# EAGLE design Raincenter_MAX232_Adapter (EAGLE 6.6.0)
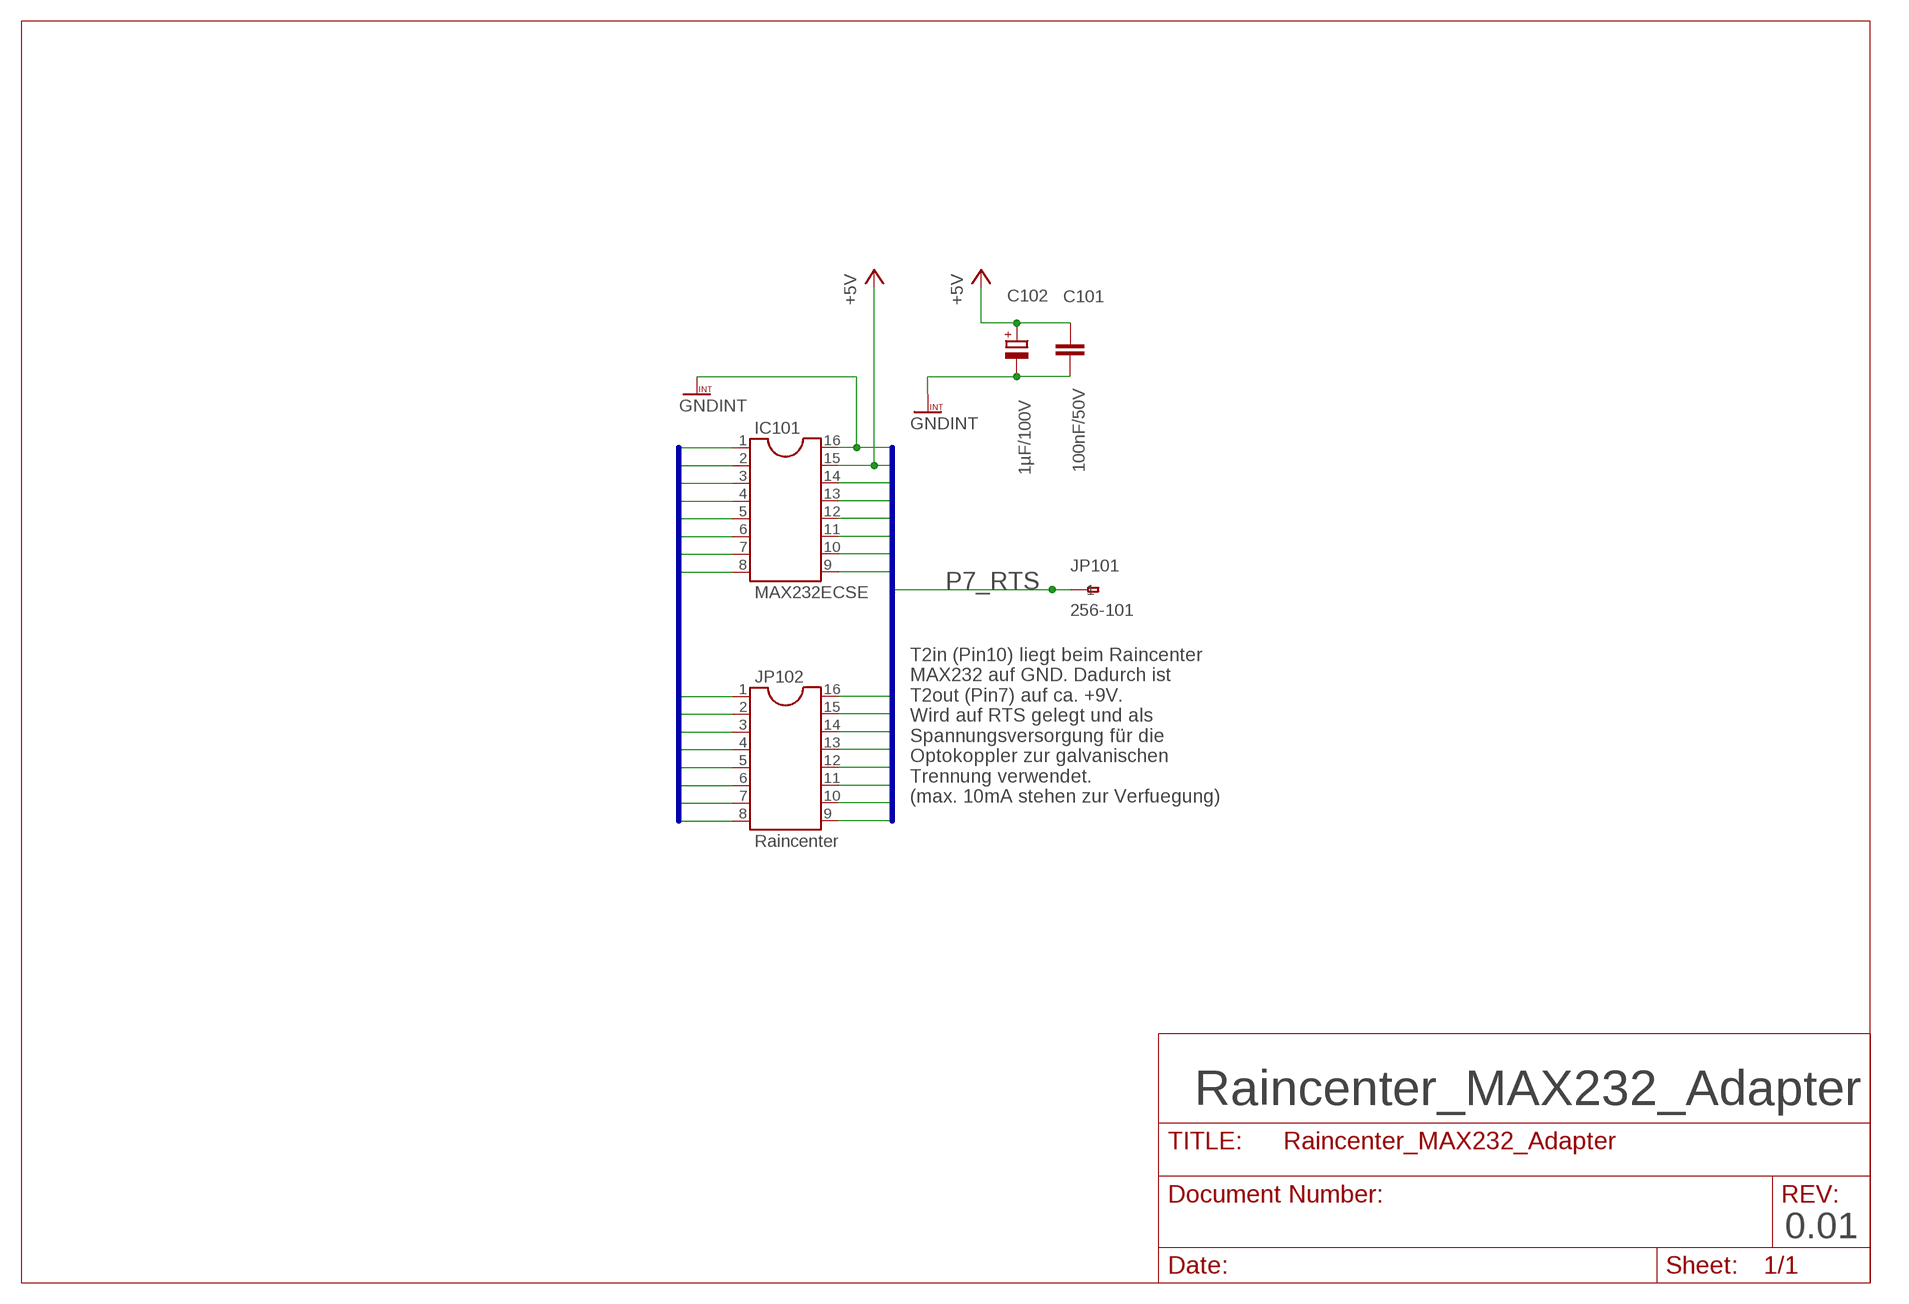
[diagram p0: schematic, sheet 1]

## Parts
C101  100nF/50V  C-EU025-024X044  [C025-024X044]
C102  1µF/100V  CPOL-EUE2.5-6  [E2,5-6]
IC101  MAX232ECSE  DIL16S  [SOCKET-16]
JP101  256-101  [255-401-5]
JP102  Raincenter  DIL16S  [SOCKET-16]

## Nets
+5V: C101.1 C102.+ IC101.15 JP102.2
GNDINT: C101.2 C102.- IC101.16 JP102.1
P1: IC101.1 JP102.16
P2: IC101.2 JP102.15
P3: IC101.3 JP102.14
P4: IC101.4 JP102.13
P5: IC101.5 JP102.12
P6: IC101.6 JP102.11
P7_RTS: IC101.7 JP101.A1 JP101.B1 JP102.10
P8: IC101.8 JP102.9
P9: IC101.9 JP102.8
P10: IC101.10 JP102.7
P11: IC101.11 JP102.6
P12: IC101.12 JP102.5
P13: IC101.13 JP102.4
P14: IC101.14 JP102.3

## Buses
P[1..6],P7_RTS,P[8..14],GNDINT,+5V

## Notes on the sheet
- T2in (Pin10) liegt beim Raincenter
  MAX232 auf GND. Dadurch ist
  T2out (Pin7) auf ca. +9V.
  Wird auf RTS gelegt und als
  Spannungsversorgung für die
  Optokoppler zur galvanischen
  Trennung verwendet.
  (max. 10mA stehen zur Verfuegung)
- Raincenter_MAX232_Adapter
- 0.01

## Library data of the parts
C101 = rcl:C-EU: CAPACITOR, European symbol; MN: Murata; REICHELT: X7R-2,5 100N
C102 = rcl:CPOL-EU: POLARIZED CAPACITOR, European symbol; REICHELT: RAD 105 1,0/100
IC101 = ic-package:DIL16: Dual In Line / Socket; REICHELT: GS 16P
JP101 = Klemmen:256-101; CONRAD: 1x730366 + 1x730378; MN: WAGO; MPN: 1x 256-101 + 1x 256-100
JP102 = ic-package:DIL16: Dual In Line / Socket; MF: ASSMANN; MPN: AR-16-ST/T; REICHELT: AR 16

## Board
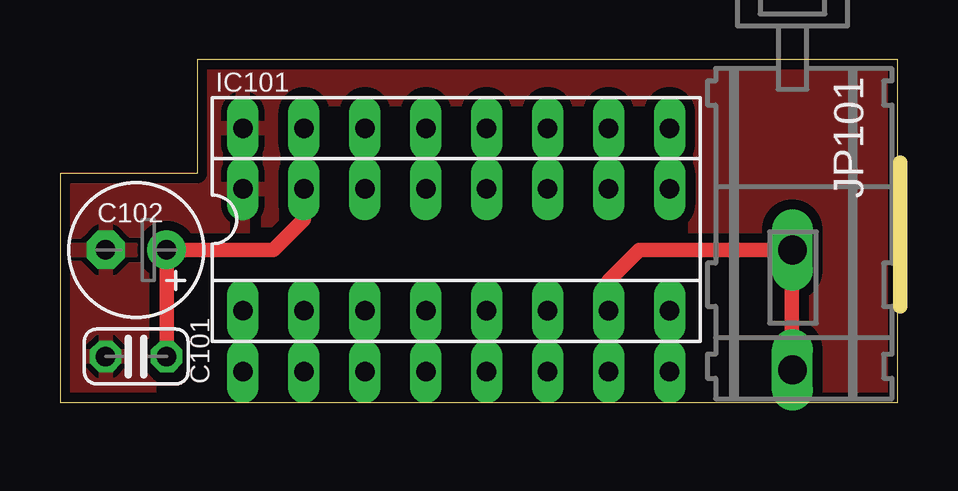
[diagram p1: board, top side]
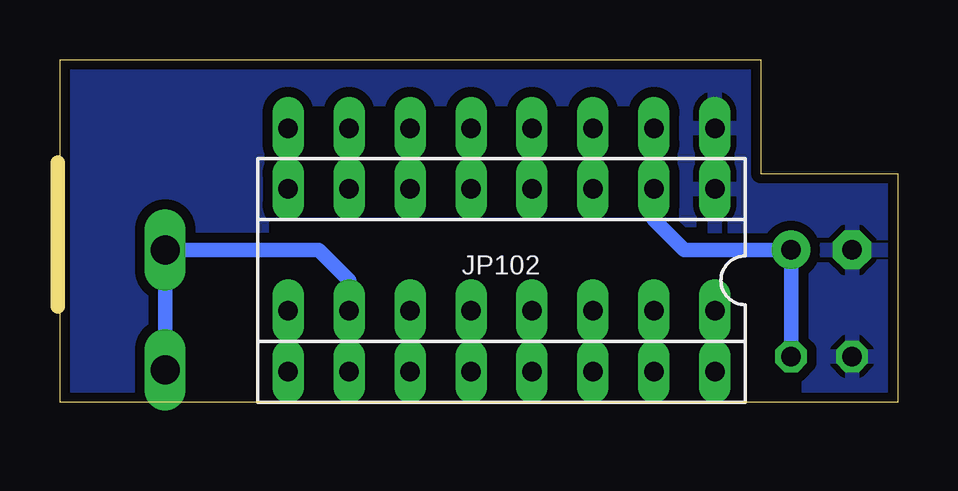
[diagram p2: board, bottom side, seen from below]

Size 34.91 x 14.28 mm. Coordinates in mm from the lower left corner, seen from the top.
Outline: 0,0 34.91,0 34.91,14.28 5.71,14.28 5.71,9.53 0,9.53 0,0
Copper layers (1*16): Top 0.035mm / dielectric 1.5mm / Bottom 0.035mm
Design rules "aisler_2_layer *": minimum track width 0.1mm, minimum drill 0.2mm, track to track 0.1mm, track to pad 0.1mm, pad to pad 0.1mm, via to via 0.1mm, smd to smd 0.1mm, copper to edge 0.2mm, drill to drill 0.21mm, minimum pad ring 0.25mm, minimum via ring 0.15mm, stop-mask expansion 0mil, vias tented up to drill 0mil, thermal gap 10mil
Milling: 1 lines

### Footprints (pad centres in the part's own frame; a part is rotated, then mirrored left to right if it is on the bottom)
C025-024X044 = drill 0.813 octagon: 1 -1.27,0; 2 1.27,0
E2,5-6 = drill 0.813 pad 1.6: + -1.27,0 | drill 0.813 pad 1.6 octagon: - 1.27,0
SOCKET-16 = drill 0.813 long: 1 -8.89,-3.81; 2 -6.35,-3.81; 3 -3.81,-3.81; 4 -1.27,-3.81; 5 1.27,-3.81; 6 3.81,-3.81; 7 6.35,-3.81; 8 8.89,-3.81; 9 8.89,3.81; 10 6.35,3.81; 11 3.81,3.81; 12 1.27,3.81; 13 -1.27,3.81; 14 -3.81,3.81; 15 -6.35,3.81; 16 -8.89,3.81
255-401-5 = drill 1.2 long: A1 -2.5,0; B1 -2.5,-5

### Placement (x,y rotation side)
C101  3.17,1.91 180 top
C102  3.17,6.35 180 top
IC101  16.51,7.62 0 top
JP101  33.02,6.35 0 top
JP102  16.51,5.08 180 bottom

### Tracks (layer width: path | path; a pad name or v marks a point on that pad's centre or on a via)
+5V
  Top 0.61: C101.1 C102.+ 8.89,6.35 10.16,7.62 JP102.2 IC101.15
  Bottom 0.61: IC101.15 JP102.2 10.16,7.62 8.89,6.35 C102.+ C101.1
GNDINT
  pour Bottom (isolate 0.406): 0,0 34.92,0 34.92,14.61 5.71,14.61 5.71,9.53 0,9.53
  pour Top (isolate 0.406): 0,0 34.92,0 34.92,14.61 5.71,14.61 5.71,9.53 0,9.53
P1
  Top 0.61: JP102.16 IC101.1
  Bottom 0.61: IC101.1 JP102.16
P2
  Top 0.61: IC101.2 JP102.15
  Bottom 0.61: IC101.2 JP102.15
P3
  Top 0.61: IC101.3 JP102.14
  Bottom 0.61: IC101.3 JP102.14
P4
  Top 0.61: JP102.13 IC101.4
  Bottom 0.61: IC101.4 JP102.13
P5
  Top 0.61: IC101.5 JP102.12
  Bottom 0.61: IC101.5 JP102.12
P6
  Top 0.61: JP102.11 IC101.6
  Bottom 0.61: IC101.6 JP102.11
P7_RTS
  Top 0.61: JP102.10 22.86,5.08 24.13,6.35 30.48,6.35 30.48,1.27
  Bottom 0.61: JP101.B1 JP101.A1 24.13,6.35 22.86,5.08 IC101.7 JP102.10
P8
  Top 0.61: JP102.9 IC101.8
  Bottom 0.61: IC101.8 JP102.9
P9
  Top 0.61: IC101.9 JP102.8
  Bottom 0.61: JP102.8 IC101.9
P10
  Top 0.61: IC101.10 JP102.7
  Bottom 0.61: JP102.7 IC101.10
P11
  Top 0.61: IC101.11 JP102.6
  Bottom 0.61: JP102.6 IC101.11
P12
  Top 0.61: IC101.12 JP102.5
  Bottom 0.61: JP102.5 IC101.12
P13
  Top 0.61: IC101.13 JP102.4
  Bottom 0.61: JP102.4 IC101.13
P14
  Top 0.61: IC101.14 JP102.3
  Bottom 0.61: JP102.3 IC101.14